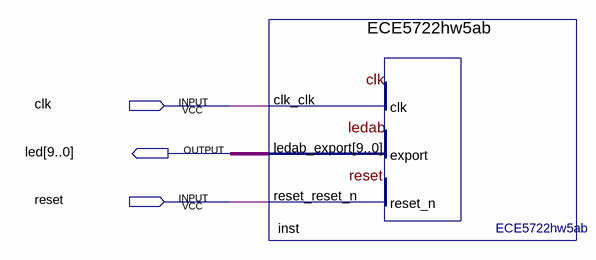
[diagram p0: schematic sheet]
// Quartus schematic ECE5722hw5b1blkd.bdf as structural Verilog: 1 symbols, 3 pins
module ECE5722hw5b1blkd (
  input  clk,
  input  reset,
  output [9:0] led
);

  ECE5722hw5ab inst (.clk_clk(clk), .reset_reset_n(reset), .ledab_export(led));
endmodule
